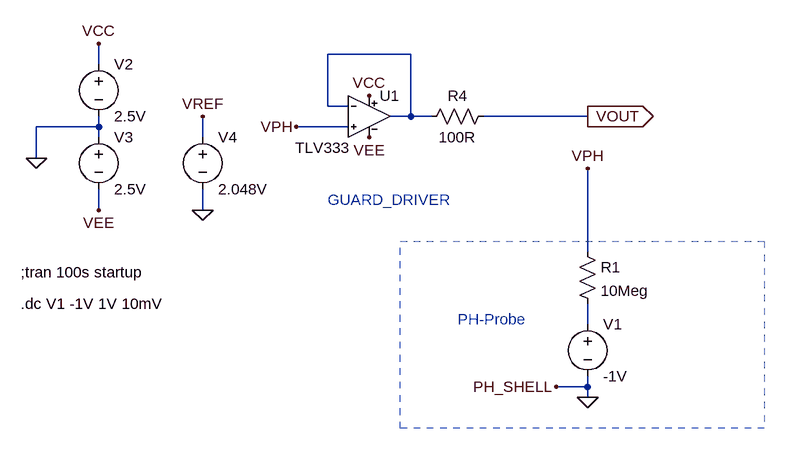
[diagram p0: schematic tlv2333.asc]
tlv2333.asc, the LTspice schematic file:
Version 4
SHEET 1 1860 680
WIRE -384 32 -512 32
WIRE -864 48 -864 16
WIRE -512 112 -512 32
WIRE -480 112 -512 112
WIRE -384 128 -384 32
WIRE -384 128 -416 128
WIRE -352 128 -384 128
WIRE -112 128 -272 128
WIRE -864 144 -864 128
WIRE -864 144 -960 144
WIRE -480 144 -560 144
WIRE -864 160 -864 144
WIRE -704 160 -704 128
WIRE -960 192 -960 144
WIRE -864 272 -864 240
WIRE -704 272 -704 240
WIRE -112 336 -112 208
WIRE -112 448 -112 416
WIRE -112 544 -112 528
WIRE -112 544 -160 544
WIRE -112 560 -112 544
FLAG -112 560 0
FLAG -448 96 VCC
FLAG -448 160 VEE
FLAG -112 128 VOUT
IOPIN -112 128 Out
FLAG -960 192 0
FLAG -864 16 VCC
FLAG -864 272 VEE
FLAG -704 128 VREF
FLAG -704 272 0
FLAG -160 544 PH_SHELL
FLAG -560 144 VPH
FLAG -112 208 VPH
SYMBOL res -128 320 R0
SYMATTR InstName R1
SYMATTR Value 10Meg
SYMBOL voltage -112 432 R0
SYMATTR InstName V1
SYMATTR Value -1V
SYMBOL res -256 112 R90
WINDOW 0 0 56 VBottom 2
WINDOW 3 32 56 VTop 2
SYMATTR InstName R4
SYMATTR Value 100R
SYMBOL voltage -864 32 R0
SYMATTR InstName V2
SYMATTR Value 2.5V
SYMBOL voltage -864 144 R0
SYMATTR InstName V3
SYMATTR Value 2.5V
SYMBOL voltage -704 144 R0
SYMATTR InstName V4
SYMATTR Value 2.048V
SYMBOL AutoGenerated\\TLV333 -448 64 R0
WINDOW 3 -114 112 Left 2
SYMATTR InstName U1
TEXT -984 368 Left 2 !;tran 100s startup
TEXT -512 256 Left 2 ;GUARD_DRIVER
TEXT -312 440 Left 2 ;PH-Probe
TEXT -984 416 Left 2 !.dc V1 -1V 1V 10mV
RECTANGLE Normal 160 608 -400 320 2

The netlist it stands for:
* tlv2333.asc
R1 VPH N002 10Meg
V1 N002 0 -1V
R4 VOUT N001 100R
V2 VCC 0 2.5V
V3 0 VEE 2.5V
V4 VREF 0 2.048V
XU1 VPH N001 VCC VEE N001 TLV333  ; pins IN+ IN- VCC VEE OUT
;tran 100s startup
* GUARD_DRIVER
* PH-Probe
.dc V1 -1V 1V 10mV
.lib TLV333.LIB
.backanno
.end